# Altium schematic sheet IR.SchDoc
size A4
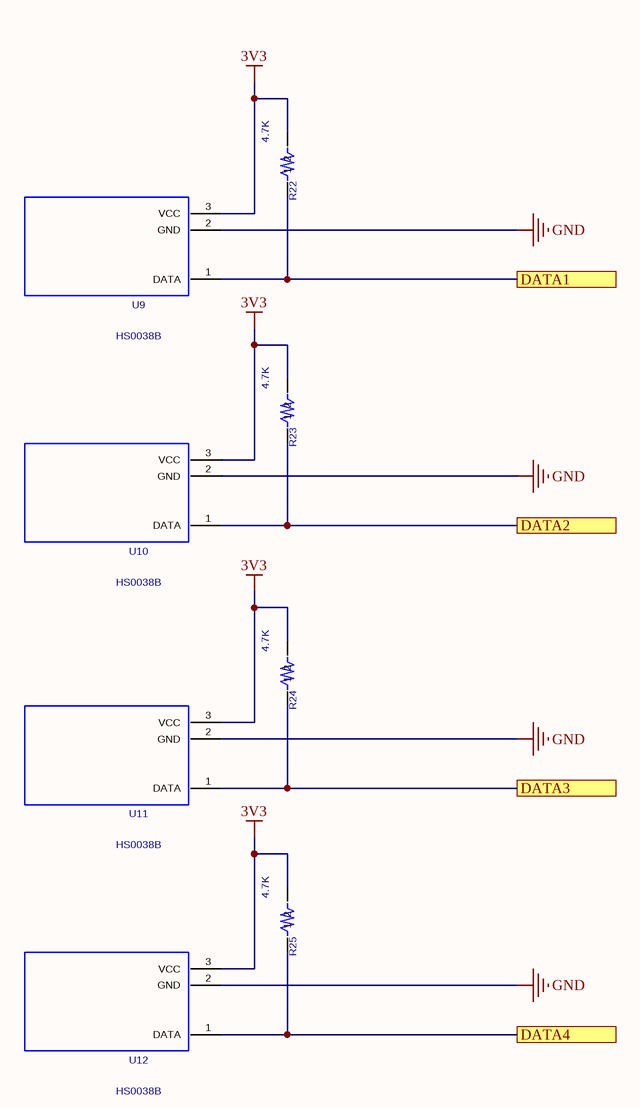
[diagram p0: IR.SchDoc]

## Parts
R22  value 4.7K  [RES_0603_FIRE]  (hidden comment: RES_4K7_0603_FIRE)
R23  value 4.7K  [RES_0603_FIRE]  (hidden comment: RES_4K7_0603_FIRE)
R24  value 4.7K  [RES_0603_FIRE]  (hidden comment: RES_4K7_0603_FIRE)
R25  value 4.7K  [RES_0603_FIRE]  (hidden comment: RES_4K7_0603_FIRE)
U9  HS0038B  [HDR1X3]
U10  HS0038B  [HDR1X3]
U11  HS0038B  [HDR1X3]
U12  HS0038B  [HDR1X3]

## Ports
DATA1, DATA2, DATA3, DATA4

## Nets
3V3: R22.2 R23.2 R24.2 R25.2 U9.3(VCC) U10.3(VCC) U11.3(VCC) U12.3(VCC)
GND: U9.2(GND) U10.2(GND) U11.2(GND) U12.2(GND)
DATA1: R22.1 U9.1(DATA) ; port DATA1
DATA2: R23.1 U10.1(DATA) ; port DATA2
DATA3: R24.1 U11.1(DATA) ; port DATA3
DATA4: R25.1 U12.1(DATA) ; port DATA4

## Library data of the parts
R22-R25 = RES_4K7_0603_FIRE: 0402; Manufacture 1: SUPEROHM; Tolerance: +-5%; PCB DECAL: RES_0603_FIRE
U9-U12 = HS0038B: Geometry.Height: 1.19990mm; Protel.FootprintDescription: Connector; Header; 3 Position; Manufacture 1 P/N: HS0038B; PCB DECAL: HDR1X3